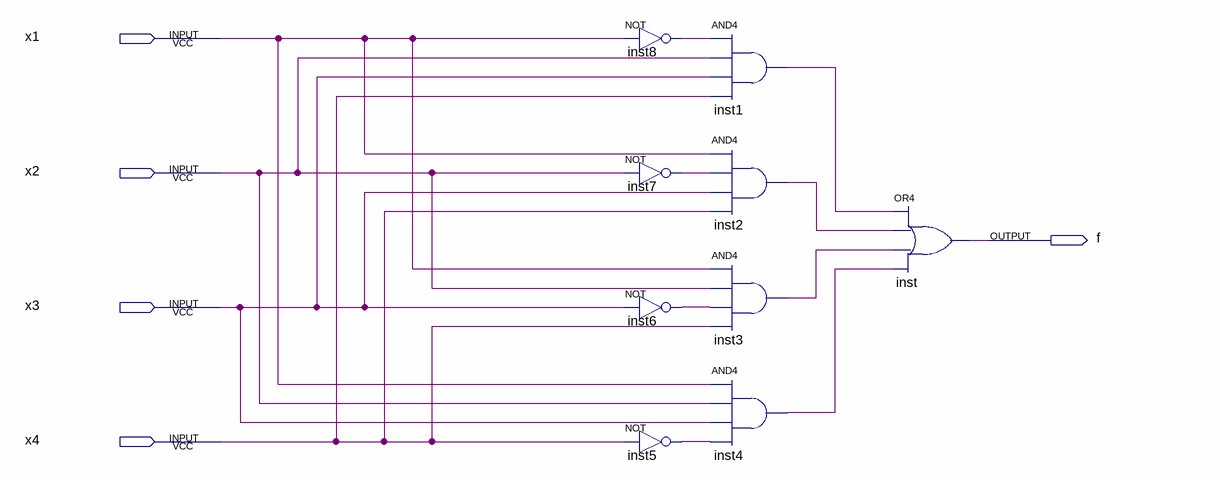
[diagram p0: schematic sheet]
// Quartus schematic Problem2b.bdf as structural Verilog: 9 symbols, 5 pins
module Problem2b (
  input  x1,
  input  x2,
  input  x3,
  input  x4,
  output f
);

  wire inst1_out, inst2_out, inst3_out, inst4_out, inst5_out, inst6_out, inst7_out, inst8_out;

  not inst8 (inst8_out, x1);
  not inst7 (inst7_out, x2);
  not inst6 (inst6_out, x3);
  not inst5 (inst5_out, x4);
  and inst1 (inst1_out, inst8_out, x2, x3, x4);
  and inst2 (inst2_out, x1, inst7_out, x3, x4);
  and inst3 (inst3_out, x1, x2, inst6_out, x4);
  and inst4 (inst4_out, x1, x2, x3, inst5_out);
  or inst (f, inst1_out, inst2_out, inst3_out, inst4_out);
endmodule
